# Altium project PCB Potencia.PrjPcb
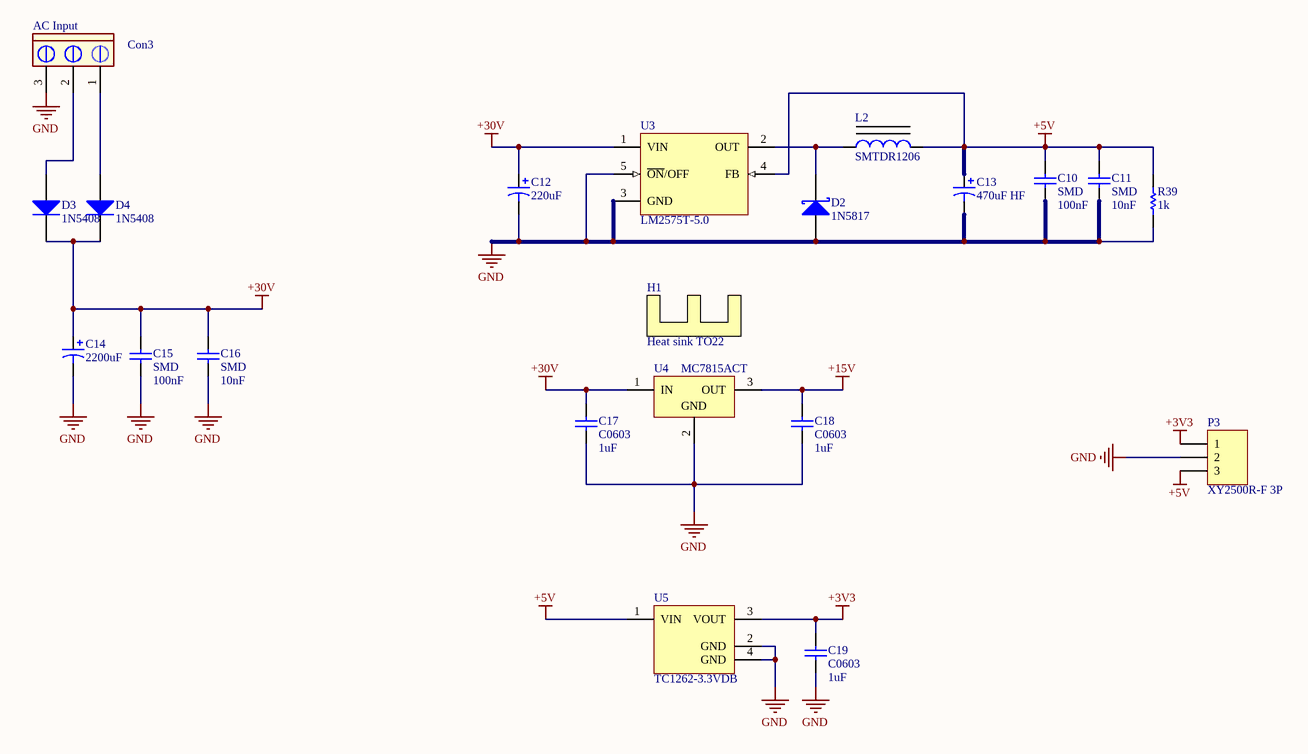
[diagram p0: Regulators.SchDoc]
3 sheets, 84 parts. Net scope: global (net labels, ports and power ports of the same name join across sheets).
Board file: Potencia.PcbDoc
Sheets:
  Regulators.SchDoc
  5V and 3V3 Outputs.SchDoc
  Variable Output 1.SchDoc

## Sheet Regulators.SchDoc
size A4

### Parts
C10  SMD  value 100nF  [1206]
C11  SMD  value 10nF  [1206]
C12  220uF  [CAPPR5-10X16]
C13  470uF HF  [CAPPR5-10X20]
C14  2200uF  [CAPPR7.5-16X35.5]
C15  SMD  value 100nF  [1206]
C16  SMD  value 10nF  [1206]
C17  C0603  value 1uF  [0603]
C18  C0603  value 1uF  [0603]
C19  C0603  value 1uF  [0603]
Con3  AC Input  [My_CN3]
D2  1N5817  [DO-41]
D3  1N5408  [DO-201AD]
D4  1N5408  [DO-201AD]
H1  Heat sink TO22  [My_Heat_sink_TO22]
L2  SMTDR1206  [SMTDR1206 Inductor]
P3  XY2500R-F 3P  [XY2500R-F 3P]
R39  value 1k  [8RB-1206]  (hidden comment: SMD)
U3  LM2575T-5.0  [T05A]
U4  MC7815ACT  [221A-04]
U5  TC1262-3.3VDB  [SOT-223-DB3_N]

### Nets
+3V3: C19.2 P3.1 U5.3(VOUT)
+5V: C10.2 C11.2 C13.1 L2.2 P3.3 R39.2 U3.4(FB) U5.1(VIN)
+15V: C18.2 U4.3(OUT)
+30V: C12.1 C14.1 C15.2 C16.2 C17.2 D3.2(K) D4.2(K) U3.1(VIN) U4.1(IN)
GND: C10.1 C11.1 C12.2 C13.2 C14.2 C15.1 C16.1 C17.1 C18.1 C19.1 Con3.3 D2.1(A) P3.2 R39.1 U3.3(GND) U3.5(~{ON}/OFF) U4.2(GND) U5.2(GND) U5.4(GND)
NetCon3_1: Con3.1 D4.1(A)
NetCon3_2: Con3.2 D3.1(A)
NetD2_2: D2.2(K) L2.1 U3.2(OUT)

### Library data of the parts
C10 C11 C15 C16 = C1206: Ceramic Chip Capacitor - Standard; Published: 17-Jul-2002; LatestRevisionDate: 19-Mar-2004; LatestRevisionNote: Silkscreen size reduced.; DatasheetDocument: Mar-2001; PackageDocument: Mar-2001; PackageReference: 1206; Publisher: Altium Limited; Code_JEITA: 1206; Code_IPC: 3216 [1206]; ComponentLink1Description: Manufacturer Link; ComponentLink1URL: http://www.kemet.com/; ComponentLink2Description: Datasheet; ComponentLink2URL: http://www.kemet.com/kemet/web/homepage/kechome.nsf/vapubfilesname/F3102TA.pdf/$file/F3102TA.pdf
C12 = EKA00DD322J00: Aluminum Electrolytic Capacitor, Radial Style with Long Leads: 220uF, 63V; Note: Refer to Manufacturer's Data Sheets for other lead formations; DrillSize: Nominal, Rounded To The Nearest 0.1mm; Published: 19-Mar-2004; DatasheetDocument: 20-Feb-2001; PackageReference: CAPPR5-10X16; Publisher: Altium Limited; ComponentLink1Description: Manufacturer Link; ComponentLink1URL: http://www.vishay.com/; ComponentLink2Description: Datasheet; ComponentLink2URL: http://www.vishay.com/docs/25014/eka.pdf; Value: 220uF
C13 = EKC00DE347E00: Aluminum Electrolytic Capacitor, Radial Style with Long Leads: 470uF, 25V; Note: Refer to Manufacturer's Data Sheets for other lead formations; DrillSize: Nominal, Rounded To The Nearest 0.1mm; Published: 19-Mar-2004; DatasheetDocument: 12-Jan-2000; PackageReference: CAPPR5-10X20; Publisher: Altium Limited; ComponentLink1Description: Manufacturer Link; ComponentLink1URL: http://www.vishay.com/; ComponentLink2Description: Datasheet; ComponentLink2URL: http://www.vishay.com/docs/25009/ekc.pdf; Value: 470uF
C14 = EKA00JL422H00: Aluminum Electrolytic Capacitor, Radial Style with Long Leads: 2200uF, 50V; Note: Refer to Manufacturer's Data Sheets for other lead formations; DrillSize: Nominal, Rounded To The Nearest 0.1mm; Published: 19-Mar-2004; DatasheetDocument: 20-Feb-2001; PackageReference: CAPPR7.5-16X35.5; Publisher: Altium Limited; ComponentLink1Description: Manufacturer Link; ComponentLink1URL: http://www.vishay.com/; ComponentLink2Description: Datasheet; ComponentLink2URL: http://www.vishay.com/docs/25014/eka.pdf; Value: 2200uF
C17-C19 = C0603: C1608X7R1C105K X7R; Note: Footprint corresponds to dimensions for bulk cassette packaging. This case size has tightened tolerances.; Published: 17-Jul-2002; LatestRevisionDate: 19-Mar-2004; LatestRevisionNote: Silkscreen size reduced.; DatasheetDocument: Mar-2001; PackageDocument: Mar-2001; PackageReference: 0603; Publisher: Altium Limited; Code_JEITA: 0603; Code_IPC: 1608 [0603]; ComponentLink1Description: Manufacturer Link; ComponentLink1URL: http://www.kemet.com/; ComponentLink2Description: Datasheet; ComponentLink2URL: http://www.kemet.com/kemet/web/homepage/kechome.nsf/vapubfilesname/F3102TA.pdf/$file/F3102TA.pdf
Con3 = CON3 pin Green: Connector green screw
D2 = 1N6095: Schottky Rectifier; Note: No PCB Footprint Available; Published: 8-Jun-2000; LatestRevisionDate: 17-Jul-2002; LatestRevisionNote: Re-released for DXP Platform.; DatasheetVersion: Dec-1997; PackageReference: DO-203AA; Publisher: Altium Limited; ComponentLink1Description: Manufacturer Link; ComponentLink1URL: http://www.irf.com/; ComponentLink2Description: Datasheet; ComponentLink2URL: http://www.irf.com/product-info/datasheets/data/1n6096.pdf
D3 D4 = Diode 1N5408: 3 Amp Medium Power Silicon Rectifier Diode; Published: 8-Jun-2000; LatestRevisionDate: 17-Jul-2002; LatestRevisionNote: Re-released for DXP Platform.; DatasheetVersion: Aug-1984; PackageReference: DO-201AD; Publisher: Altium Limited; PackageDescription: Diode, Axial; Body 9.5 x 5.3 mm (LxDia. max), Lead Dia. 1.32 mm (max); ComponentLink1Description: Manufacturer Link; ComponentLink1URL: http://www.irf.com/
H1 = Heat sink TO22: Heat sink for TO22
L2 = 100UHY SMD 18.54X7.11MM 20% 3A 0.19E SMTDR1206-101M: Value: 100uH
P3 = XY2500R-F 3P: HEADER 3P P/CI 90gra VERDE P=3.81MM XY2500R-F
R39 = ERJ8BQ: Low Ohmic Value Thick Film Chip Resistor, 0.22 Ohm to 9.1 Ohm Range, 1%, 2% and 5% Tolerance, 1206 Size, 0.33 W; Published: 17-Dec-2003; LatestRevisionDate: 19-Mar-2004; LatestRevisionNote: Silkscreen size reduced.; PackageDocument: Mar-2003; PackageReference: 8RB-1206; Publisher: Altium Limited; Code_IPC: 3216 [1206]; ComponentLink1Description: Manufacturer Link; ComponentLink1URL: http://www.panasonic.com/industrial/components/resistive_products.htm; ComponentLink2Description: Datasheet; ComponentLink2URL: http://www.panasonic.com/industrial/components/pdf/AOA0000CE3.pdf
U3 = LM2575T-5.0: SIMPLE SWITCHER® 1A Step-Down Voltage Regulator, 5-pin TO-220; Manufacturer: National Semiconductor; PackageTopMarking: NSUZXYTTE#*LM2575T*-5.0 P+; PowerWise: N; Published: 4-Dec-2008; DatasheetVersion: Apr-2007; PackageVersion: revJ, Jan-1992; PackageReference: T05A; Publisher: Altium Limited; PackageDescription: TO-220, Molded, 5 Lead, Straight; Supplier 1: Farnell; Supplier Part Number 1: 1523839; Supplier 2: Farnell; Supplier Part Number 2: 9488090; PartNumber: LM2575T-5.0; RoHS: N; PinCount: 5; CompType: Switcher; Code_JEDEC: TO-220-AB; ComponentLink1Description: LM2575 Datasheet; ComponentLink1URL: http://www.national.com/ds/LM/LM2575.pdf; ComponentLink2Description: LM2575 Web Page; ComponentLink2URL: http://www.national.com/pf/LM/LM2575.html; ComponentLink3Description: T05A Package Page; ComponentLink3URL: http://www.national.com/packaging/folders/t05a.html
U4 = MC7815ACT: 3-Terminal Positive Fixed Voltage Regulator; Note: Pin 2 is electrically connected to TAB; Published: 17-Jul-2002; DatasheetVersion: 1988; PackageReference: 221A-04; Publisher: Altium Limited; PackageDescription: TO, Thru-Hole, Vertical, Heatsink Mounted; 3 In-Line Leads; Pitch 2.54 mm; Code_JEDEC: TO-262-AA; ComponentLink1Description: Manufacturer Link; ComponentLink1URL: http://www.onsemi.com/site/products/taxonomy/0,4438,503,00.html; ComponentLink2Description: Datasheet; ComponentLink2URL: http://www.onsemi.com/pub/Collateral/MC7800-D.PDF
U5 = TC1262-3.3VDB: 500mA Fixed Output CMOS LDO, 3-Pin SOT-223, Extended Temperature; Published: 29-Jan-2009; DatasheetVersion: revB, 2002; PackageVersion: revBB, Aug-2009; PackageReference: SOT-223-DB3; Publisher: Altium Limited; PackageDescription: 3-Lead Plastic Small Outline Transistor (DB) [SOT-223]; Supplier 1: Digi-Key; Supplier Part Number 1: TC1262-3.3VDB-ND; ComponentLink1Description: Datasheet; ComponentLink1URL: http://ww1.microchip.com/downloads/en/DeviceDoc/21373b.pdf; ComponentLink2Description: Packaging Specification; ComponentLink2URL: http://www.microchip.com/stellent/groups/techpub_sg/documents/packagingspec/en012702.pdf; ComponentLink3Description: Microchip.com Home; ComponentLink3URL: http://www.microchip.com/

## Sheet 5V and 3V3 Outputs.SchDoc
size A4
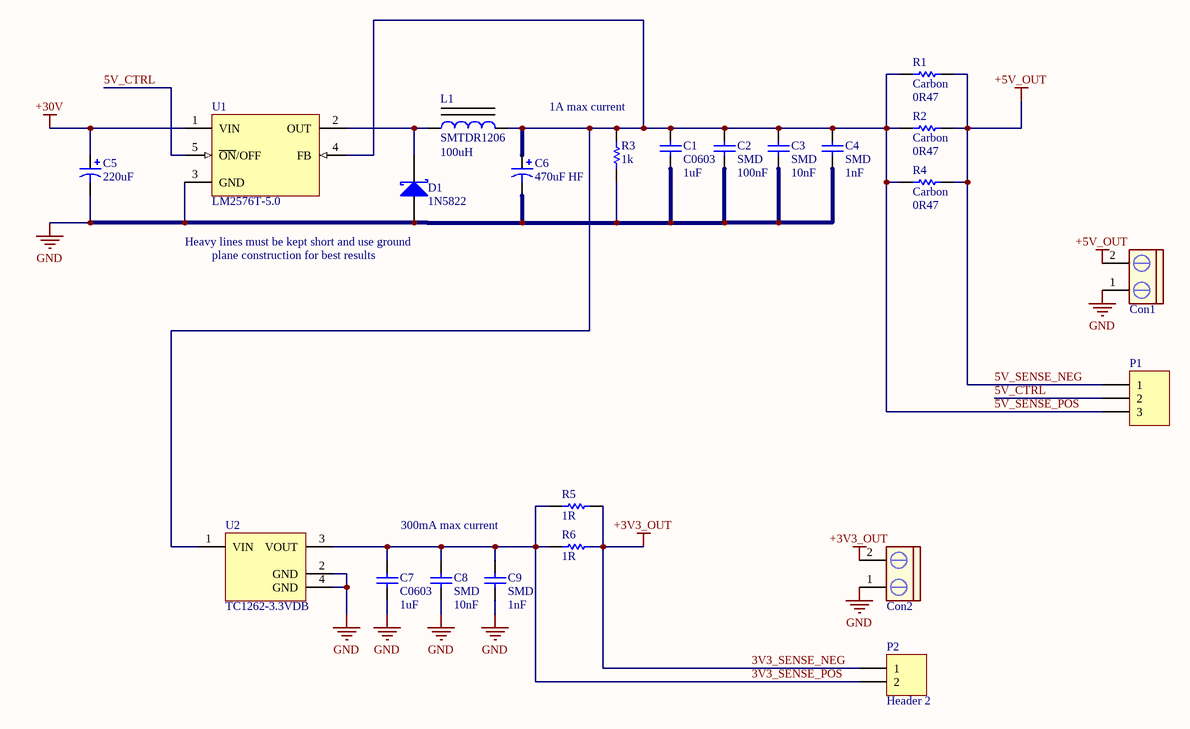
[diagram p1: 5V and 3V3 Outputs.SchDoc]

### Parts
C1  C0603  value 1uF  [0603]
C2  SMD  value 100nF  [1206]
C3  SMD  value 10nF  [1206]
C4  SMD  value 1nF  [1206]
C5  220uF  [CAPPR5-10X16]
C6  470uF HF  [CAPPR5-10X20]
C7  C0603  value 1uF  [0603]
C8  SMD  value 10nF  [1206]
C9  SMD  value 1nF  [1206]
Con1  Salida Buck  [My_CN2]  (value not drawn)
Con2  Salida Buck  [My_CN2]  (value not drawn)
D1  1N5822  [Vertical DO-201AD]
L1  SMTDR1206  value 100uH  [SMTDR1206 Inductor]
P1  Header 3  [My_1X03]  (value not drawn)
P2  Header 2  [HDR1X2]
R1  Carbon  value 0R47  [AXIAL-0.3]
R2  Carbon  value 0R47  [AXIAL-0.3]
R3  value 1k  [8RB-1206]  (hidden comment: SMD)
R4  Carbon  value 0R47  [AXIAL-0.3]
R5  value 1R  [8RB-1206]  (hidden comment: SMD)
R6  value 1R  [8RB-1206]  (hidden comment: SMD)
U1  LM2576T-5.0  [T05A]
U2  TC1262-3.3VDB  [SOT-223-DB3_N]

### Nets
3V3_SENSE_NEG: Con2.2 P2.1 R5.2 R6.2  [also labelled +3V3_OUT]
5V_SENSE_NEG: Con1.2 P1.1 R1.2 R2.2 R4.2  [also labelled +5V_OUT]
+30V: C5.1 U1.1(VIN)
GND: C1.1 C2.1 C3.1 C4.1 C5.2 C6.2 C7.1 C8.1 C9.1 Con1.1 Con2.1 D1.1(A) R3.1 U1.3(GND) U2.2(GND) U2.4(GND)
3V3_SENSE_POS: C7.2 C8.2 C9.2 P2.2 R5.1 R6.1 U2.3(VOUT)
5V_CTRL: P1.2 U1.5(~{ON}/OFF)
5V_SENSE_POS: C1.2 C2.2 C3.2 C4.2 C6.1 L1.2 P1.3 R1.1 R2.1 R3.2 R4.1 U1.4(FB) U2.1(VIN)
NetD1_2: D1.2(K) L1.1 U1.2(OUT)

### Notes on the sheet
- (near R3) 1A max current
- Heavy lines must be kept short and use ground
- plane construction for best results
- 300mA max current

### Library data of the parts
C1 C7 = C0603: as C17 on sheet Regulators; Published: 17-Jul-2002; LatestRevisionDate: 19-Mar-2004; LatestRevisionNote: Silkscreen size reduced.; DatasheetDocument: Mar-2001; PackageDocument: Mar-2001; PackageReference: 0603; Publisher: Altium Limited; Code_JEITA: 0603; Code_IPC: 1608 [0603]; ComponentLink1Description: Manufacturer Link; ComponentLink1URL: http://www.kemet.com/; ComponentLink2Description: Datasheet; ComponentLink2URL: http://www.kemet.com/kemet/web/homepage/kechome.nsf/vapubfilesname/F3102TA.pdf/$file/F3102TA.pdf
C2-C4 C8 C9 = C1206: Ceramic Chip Capacitor - Standard; Published: 17-Jul-2002; LatestRevisionDate: 19-Mar-2004; LatestRevisionNote: Silkscreen size reduced.; DatasheetDocument: Mar-2001; PackageDocument: Mar-2001; PackageReference: 1206; Publisher: Altium Limited; Code_JEITA: 1206; Code_IPC: 3216 [1206]; ComponentLink1Description: Manufacturer Link; ComponentLink1URL: http://www.kemet.com/; ComponentLink2Description: Datasheet; ComponentLink2URL: http://www.kemet.com/kemet/web/homepage/kechome.nsf/vapubfilesname/F3102TA.pdf/$file/F3102TA.pdf
C5 = EKA00DD322J00: as C12 on sheet Regulators; Published: 19-Mar-2004; DatasheetDocument: 20-Feb-2001; PackageReference: CAPPR5-10X16; Publisher: Altium Limited; ComponentLink1Description: Manufacturer Link; ComponentLink1URL: http://www.vishay.com/; ComponentLink2Description: Datasheet; ComponentLink2URL: http://www.vishay.com/docs/25014/eka.pdf; Value: 220uF
C6 = EKC00DE347E00: as C13 on sheet Regulators; Published: 19-Mar-2004; DatasheetDocument: 12-Jan-2000; PackageReference: CAPPR5-10X20; Publisher: Altium Limited; ComponentLink1Description: Manufacturer Link; ComponentLink1URL: http://www.vishay.com/; ComponentLink2Description: Datasheet; ComponentLink2URL: http://www.vishay.com/docs/25009/ekc.pdf; Value: 470uF
Con1 Con2 = CON2 pin blue: Connector blue screw
D1 = Generic Schottky Diode
L1 = 100UHY SMD 18.54X7.11MM 20% 3A 0.19E SMTDR1206-101M
P1 = Header 3: Header, 3-Pin; LatestRevisionDate: 17-Jul-2002; LatestRevisionNote: Re-released for DXP Platform.; Publisher: Altium Limited
P2 = Header 2: Header, 2-Pin; LatestRevisionDate: 17-Jul-2002; LatestRevisionNote: Re-released for DXP Platform.; Publisher: Altium Limited
R1 R2 R4 = Res1: Resistor; Published: 8-Jun-2000; LatestRevisionDate: 17-Jul-2002; LatestRevisionNote: Re-released for DXP Platform.; PackageReference: AXIAL-0.3; Publisher: Altium Limited; PackageDescription: Axial Device, Thru-Hole; 2 Leads; 0.3 in Pin Spacing
R3 R5 R6 = ERJ8BQ: as R39 on sheet Regulators; Published: 17-Dec-2003; LatestRevisionDate: 19-Mar-2004; LatestRevisionNote: Silkscreen size reduced.; PackageDocument: Mar-2003; PackageReference: 8RB-1206; Publisher: Altium Limited; Code_IPC: 3216 [1206]; ComponentLink1Description: Manufacturer Link; ComponentLink1URL: http://www.panasonic.com/industrial/components/resistive_products.htm; ComponentLink2Description: Datasheet; ComponentLink2URL: http://www.panasonic.com/industrial/components/pdf/AOA0000CE3.pdf
U1 = LM2576T-5.0: SIMPLE SWITCHER® 3A Step-Down Voltage Regulator, 5-pin TO-220; Manufacturer: National Semiconductor; PackageTopMarking: NSUZXYTTE#*LM2576T*-5.0 P+; PowerWise: N; Published: 4-Dec-2008; DatasheetVersion: Aug-2004; PackageVersion: revJ, Jan-1992; PackageReference: T05A; Publisher: Altium Limited; PackageDescription: TO-220, Molded, 5 Lead, Straight; Supplier 1: Farnell; Supplier Part Number 1: 9488138; Supplier 2: Farnell; Supplier Part Number 2: 1523840; PartNumber: LM2576T-5.0; RoHS: N; PinCount: 5; CompType: Switcher; Code_JEDEC: TO-220-AB; ComponentLink1Description: LM2576 Datasheet; ComponentLink1URL: http://www.national.com/ds/LM/LM2576.pdf; ComponentLink2Description: LM2576 Web Page; ComponentLink2URL: http://www.national.com/pf/LM/LM2576.html; ComponentLink3Description: T05A Package Page; ComponentLink3URL: http://www.national.com/packaging/folders/t05a.html
U2 = TC1262-3.3VDB: as U5 on sheet Regulators; Published: 29-Jan-2009; DatasheetVersion: revB, 2002; PackageVersion: revBB, Aug-2009; PackageReference: SOT-223-DB3; Publisher: Altium Limited; PackageDescription: 3-Lead Plastic Small Outline Transistor (DB) [SOT-223]; Supplier 1: Digi-Key; Supplier Part Number 1: TC1262-3.3VDB-ND; ComponentLink1Description: Datasheet; ComponentLink1URL: http://ww1.microchip.com/downloads/en/DeviceDoc/21373b.pdf; ComponentLink2Description: Packaging Specification; ComponentLink2URL: http://www.microchip.com/stellent/groups/techpub_sg/documents/packagingspec/en012702.pdf; ComponentLink3Description: Microchip.com Home; ComponentLink3URL: http://www.microchip.com/

## Sheet Variable Output 1.SchDoc
size A4
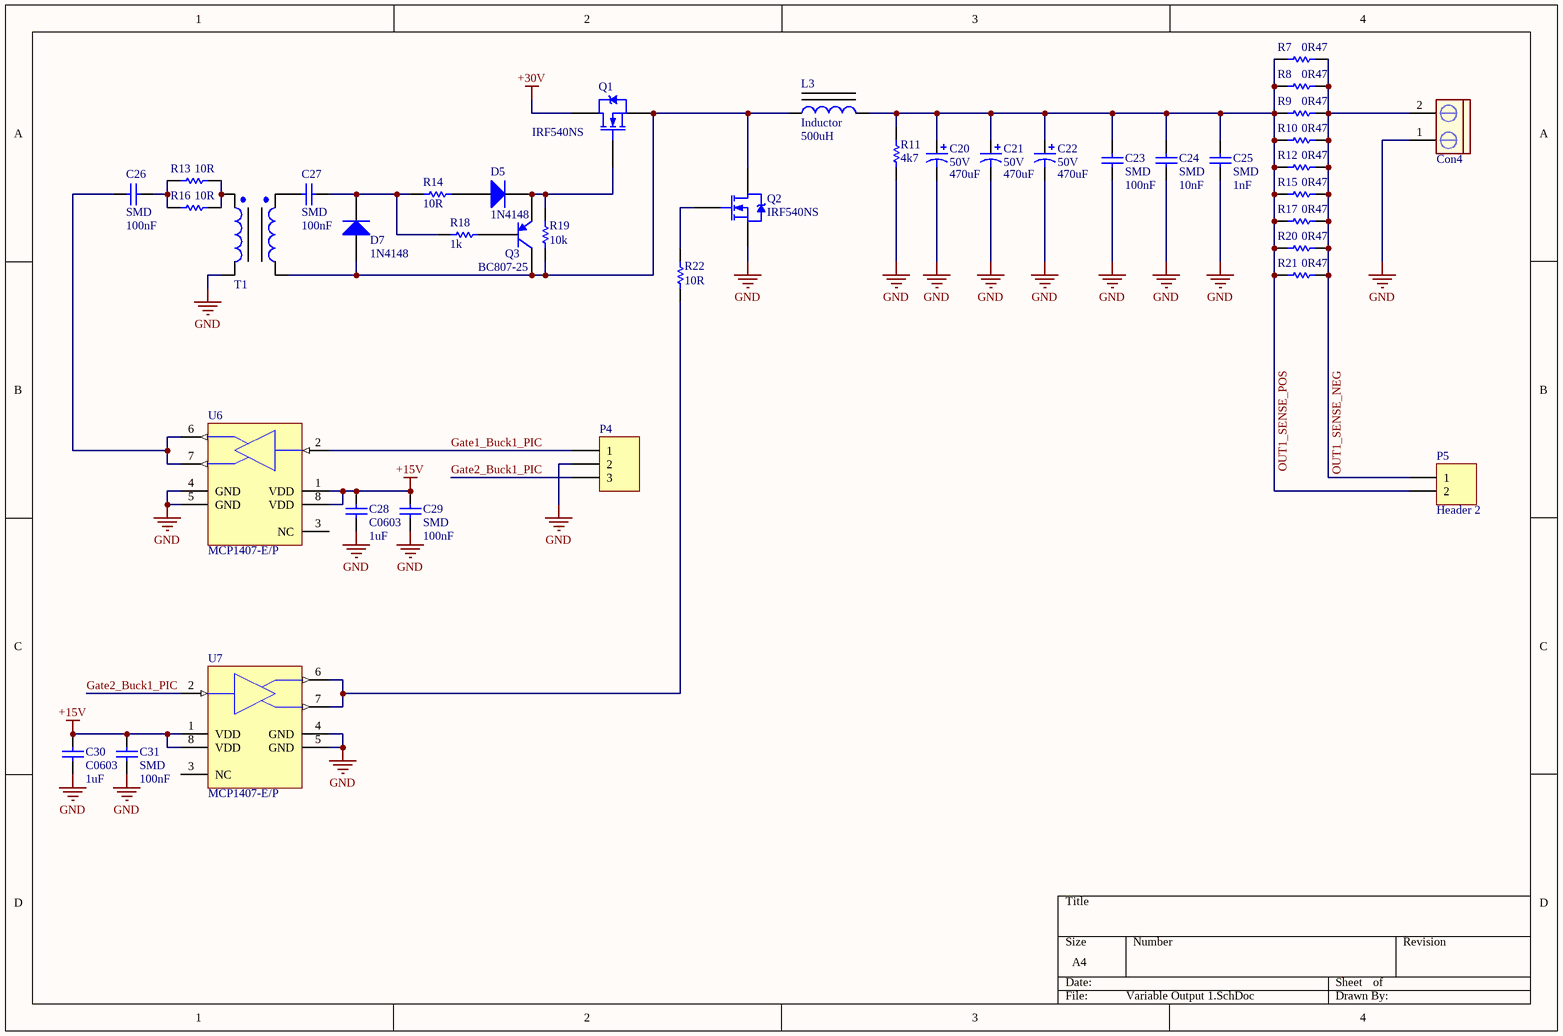
[diagram p2: Variable Output 1.SchDoc]

### Parts
C20  50V  value 470uF  [CAPPR5-10X20]
C21  50V  value 470uF  [CAPPR5-10X20]
C22  50V  value 470uF  [CAPPR5-10X20]
C23  SMD  value 100nF  [1206]
C24  SMD  value 10nF  [1206]
C25  SMD  value 1nF  [1206]
C26  SMD  value 100nF  [1206]
C27  SMD  value 100nF  [1206]
C28  C0603  value 1uF  [0603]
C29  SMD  value 100nF  [1206]
C30  C0603  value 1uF  [0603]
C31  SMD  value 100nF  [1206]
Con4  Salida Buck  [My_CN2]  (value not drawn)
D5  1N4148  [SOD80C]
D7  1N4148  [SOD80C]
L3  Inductor  value 500uH  [R33x19x11 Toroid Vertical]
P4  Header 3  [My_1X03]  (value not drawn)
P5  Header 2  [HDR1X2]
Q1  IRF540NS  [D2PAK_N]
Q2  IRF540NS  [D2PAK_N]
Q3  BC807-25  [SOT-23A_N]
R7  value 0R47  [AXIAL-0.3]  (hidden comment: Carbon)
R8  value 0R47  [AXIAL-0.3]  (hidden comment: Carbon)
R9  value 0R47  [AXIAL-0.3]  (hidden comment: Carbon)
R10  value 0R47  [AXIAL-0.3]  (hidden comment: Carbon)
R11  value 4k7  [8RB-1206]  (hidden comment: SMD)
R12  value 0R47  [AXIAL-0.3]  (hidden comment: Carbon)
R13  value 10R  [8RB-1206]  (hidden comment: SMD 1206)
R14  value 10R  [8RB-1206]  (hidden comment: SMD 1206)
R15  value 0R47  [AXIAL-0.3]  (hidden comment: Carbon)
R16  value 10R  [8RB-1206]  (hidden comment: SMD 1206)
R17  value 0R47  [AXIAL-0.3]  (hidden comment: Carbon)
R18  value 1k  [8RB-1206]  (hidden comment: SMD)
R19  value 10k  [8RB-1206]  (hidden comment: SMD)
R20  value 0R47  [AXIAL-0.3]  (hidden comment: Carbon)
R21  value 0R47  [AXIAL-0.3]  (hidden comment: Carbon)
R22  value 10R  [8RB-1206]  (hidden comment: SMD 1206)
T1  Gate Driver Transformer 15mm Toroidal  [Gate Driver Transformer 15mm Toroidal]  (value not drawn)
U6  MCP1407-E/P  [PDIP300-P8]
U7  MCP1407-E/P  [PDIP300-P8]

### Nets
+15V: C28.2 C29.2 C30.2 C31.2 U6.1(VDD) U6.8(VDD) U7.1(VDD) U7.8(VDD)
+30V: Q1.2(D)
GND: C20.2 C21.2 C22.2 C23.1 C24.1 C25.1 C28.1 C29.1 C30.1 C31.1 Con4.1 P4.2 Q2.3(S) R11.1 T1.2 U6.4(GND) U6.5(GND) U7.4(GND) U7.5(GND)
Gate1_Buck1_PIC: P4.1 U6.2(IN)
Gate2_Buck1_PIC: P4.3 U7.2(IN)
OUT1_SENSE_NEG: Con4.2 P5.1 R7.2 R8.2 R9.2 R10.2 R12.2 R15.2 R17.2 R20.2 R21.2
OUT1_SENSE_POS: C20.1 C21.1 C22.1 C23.2 C24.2 C25.2 L3.2 P5.2 R7.1 R8.1 R9.1 R10.1 R11.2 R12.1 R15.1 R17.1 R20.1 R21.1
NetC26_1: C26.1 U6.6(OUT) U6.7(OUT)
NetC26_2: C26.2 R13.1 R16.1
NetC27_1: C27.1 T1.3
NetC27_2: C27.2 D7.2(K) R14.1 R18.2
NetD5_1: D5.1(A) R14.2
NetD5_2: D5.2(K) Q1.1(G) Q3.2(E) R19.2
NetD7_1: D7.1(A) L3.1 Q1.3(S) Q2.2(D) Q3.3(C) R19.1 T1.4
NetQ2_1: Q2.1(G) R22.1
NetQ3_1: Q3.1(B) R18.1
NetR13_2: R13.2 R16.2 T1.1
NetR22_2: R22.2 U7.6(OUT) U7.7(OUT)

Not connected (* = marked no-connect by the designer): U6 3(NC); U7 3(NC)

### Library data of the parts
C20-C22 = EKB00DE347H00: Aluminum Electrolytic Capacitor, Radial Style with Long Leads: 470uF, 50V; Note: Refer to Manufacturer's Data Sheets for other lead formations; DrillSize: Nominal, Rounded To The Nearest 0.1mm; Published: 19-Mar-2004; DatasheetDocument: 21-Feb-2001; PackageReference: CAPPR5-10X20; Publisher: Altium Limited; ComponentLink1Description: Manufacturer Link; ComponentLink1URL: http://www.vishay.com/; ComponentLink2Description: Datasheet; ComponentLink2URL: http://www.vishay.com/docs/25013/ekb.pdf
C23-C27 C29 C31 = C1206: Ceramic Chip Capacitor - Standard; Published: 17-Jul-2002; LatestRevisionDate: 19-Mar-2004; LatestRevisionNote: Silkscreen size reduced.; DatasheetDocument: Mar-2001; PackageDocument: Mar-2001; PackageReference: 1206; Publisher: Altium Limited; Code_JEITA: 1206; Code_IPC: 3216 [1206]; ComponentLink1Description: Manufacturer Link; ComponentLink1URL: http://www.kemet.com/; ComponentLink2Description: Datasheet; ComponentLink2URL: http://www.kemet.com/kemet/web/homepage/kechome.nsf/vapubfilesname/F3102TA.pdf/$file/F3102TA.pdf
C28 C30 = C0603: as C17 on sheet Regulators; Published: 17-Jul-2002; LatestRevisionDate: 19-Mar-2004; LatestRevisionNote: Silkscreen size reduced.; DatasheetDocument: Mar-2001; PackageDocument: Mar-2001; PackageReference: 0603; Publisher: Altium Limited; Code_JEITA: 0603; Code_IPC: 1608 [0603]; ComponentLink1Description: Manufacturer Link; ComponentLink1URL: http://www.kemet.com/; ComponentLink2Description: Datasheet; ComponentLink2URL: http://www.kemet.com/kemet/web/homepage/kechome.nsf/vapubfilesname/F3102TA.pdf/$file/F3102TA.pdf
Con4 = CON2 pin blue: Connector blue screw
D5 D7 = 1N4148: High Conductance Fast Diode; Published: 8-Jun-2000; LatestRevisionDate: 17-Jul-2002; LatestRevisionNote: Re-released for DXP Platform.; DatasheetDocument: 1997; PackageReference: DO-35; Publisher: Altium Limited; Code_JEDEC: DO-204-AH; ComponentLink1Description: Manufacturer Link; ComponentLink1URL: http://www.fairchildsemi.com/; ComponentLink2Description: Datasheet; ComponentLink2URL: http://www.fairchildsemi.com/ds/1N%2F1N4148.pdf
L3 = Generic Inductor
P4 = Header 3: Header, 3-Pin; LatestRevisionDate: 17-Jul-2002; LatestRevisionNote: Re-released for DXP Platform.; Publisher: Altium Limited
P5 = Header 2: Header, 2-Pin; LatestRevisionDate: 17-Jul-2002; LatestRevisionNote: Re-released for DXP Platform.; Publisher: Altium Limited
Q1 Q2 = IRF540NS: HEXFET Power MOSFET; Published: 8-Jun-2000; LatestRevisionDate: 20-Nov-2009; LatestRevisionNote: IPC-7351 Footprint Added.; DatasheetVersion: May-1998; PackageReference: D2PAK; Publisher: Altium Limited; PackageDescription: 3-Pin Transistor Outline Package 2.54 mm Pitch, 15.1 mm Lead Span; ComponentLink1Description: Manufacturer Link; ComponentLink1URL: http://www.irf.com/; ComponentLink2Description: Datasheet; ComponentLink2URL: http://www.irf.com/product-info/datasheets/data/irf540ns.pdf
Q3 = BC807-25: PNP General Purpose Amplifier; Published: 8-Jun-2000; LatestRevisionDate: 20-Nov-2009; LatestRevisionNote: IPC-7351 Footprint Added.; DatasheetVersion: 1997; PackageVersion: Sep-1998; PackageReference: SOT-23A; Publisher: Altium Limited; PackageDescription: 3-Pin SOT-23 Package 0.95 mm Pitch, 2.3 mm Lead Span; ComponentLink1Description: Manufacturer Link; ComponentLink1URL: http://www.fairchildsemi.com/; ComponentLink2Description: Datasheet; ComponentLink2URL: http://www.fairchildsemi.com/ds/BC%2FBC807.pdf
R7-R10 R12 R15 R17 R20 R21 = Res1: Resistor; Published: 8-Jun-2000; LatestRevisionDate: 17-Jul-2002; LatestRevisionNote: Re-released for DXP Platform.; PackageReference: AXIAL-0.3; Publisher: Altium Limited; PackageDescription: Axial Device, Thru-Hole; 2 Leads; 0.3 in Pin Spacing
R11 R13 R14 R16 R18 R19 R22 = ERJ8BQ: as R39 on sheet Regulators; Published: 17-Dec-2003; LatestRevisionDate: 19-Mar-2004; LatestRevisionNote: Silkscreen size reduced.; PackageDocument: Mar-2003; PackageReference: 8RB-1206; Publisher: Altium Limited; Code_IPC: 3216 [1206]; ComponentLink1Description: Manufacturer Link; ComponentLink1URL: http://www.panasonic.com/industrial/components/resistive_products.htm; ComponentLink2Description: Datasheet; ComponentLink2URL: http://www.panasonic.com/industrial/components/pdf/AOA0000CE3.pdf
U6 U7 = MCP1407-E/P: 6A High-Speed Power MOSFET Drivers, Non Inverting, Extended Temperature; Published: 29-Jan-2009; LatestRevisionDate: 01-Mar-2010; LatestRevisionNote: Sch Layout changed.; DatasheetVersion: revA, Dec-2006; PackageVersion: revBB, Aug-2009; PackageReference: PDIP300-P8; Publisher: Altium Limited; PackageDescription: 8-Lead Plastic Dual In-Line (P) - 300 mil Body [PDIP]; Supplier 1: Digi-Key; Supplier Part Number 1: MCP1407-E/P-ND; Supplier 2: Farnell; Supplier Part Number 2: 1317124; Code_JEDEC: MS-001; ComponentLink1Description: Datasheet; ComponentLink1URL: http://ww1.microchip.com/downloads/en/DeviceDoc/22019a.pdf; ComponentLink2Description: Packaging Specification; ComponentLink2URL: http://www.microchip.com/stellent/groups/techpub_sg/documents/packagingspec/en012702.pdf; ComponentLink3Description: Microchip.com Home; ComponentLink3URL: http://www.microchip.com/

## Nets that join several sheets
+15V: Regulators (C18.2 U4.3), Variable Output 1 (8 pins)
+30V: Regulators (9 pins), 5V and 3V3 Outputs (C5.1 U1.1), Variable Output 1 (Q1.2)
GND: Regulators (19 pins), 5V and 3V3 Outputs (16 pins), Variable Output 1 (19 pins)